# Altium schematic sheet RELAY7.SchDoc
size A
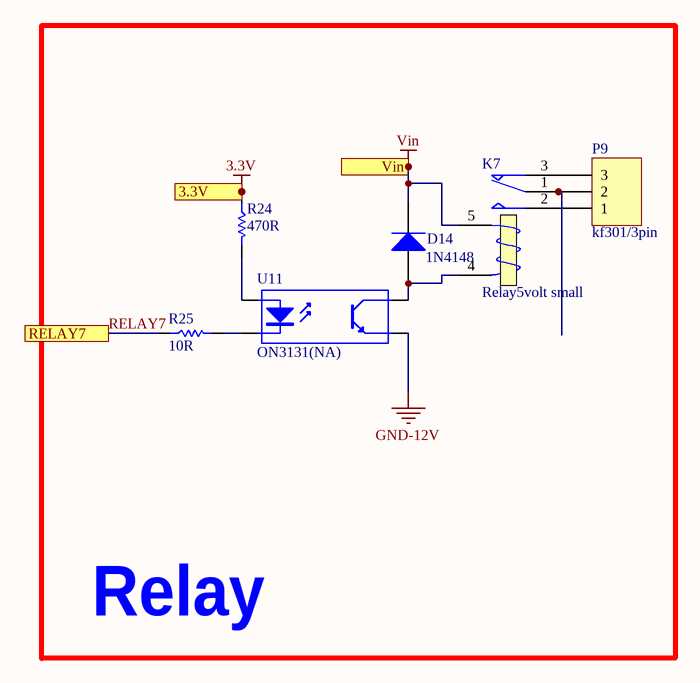
[diagram p0: RELAY7.SchDoc]

## Parts
D14  1N4148  [sod123]
K7  Relay5volt small  [relay5_childern]
P9  kf301/3pin  [Blue Connector 1*3 -kf301]
R24  470R  [0805/resistor]
R25  10R  [0805/resistor]
U11  ON3131(NA)  [OPTO_COUPLER]

## Blocks framed on the sheet
Relay: D14 K7 P9 R24 R25 U11

## Ports
3.3V, RELAY7, Vin

## Nets
3.3V: R24.1 ; port 3.3V
GND-12V: U11.3(E)
Vin: D14.K K7.5 ; port Vin
RELAY7: R25.1 ; port RELAY7
NetD14_A: D14.A K7.4(T2) U11.4(C)
NetK7_1: K7.1(COM) P9.2
NetK7_2: K7.2(NO) P9.1
NetK7_3: K7.3(T1) P9.3
NetR24_2: R24.2 U11.1(A)
NetR25_2: R25.2 U11.2(K)

## Library data of the parts
D14 = Diode 1N4007: 1 Amp General Purpose Rectifier; Published: 8-Jun-2000; LatestRevisionDate: 17-Jul-2002; LatestRevisionNote: Re-released for DXP Platform.; DatasheetVersion: 1998; PackageVersion: Aug-1999; PackageReference: DO-41; Publisher: Altium Limited; PackageDescription: Diode, Axial; Body 5.2 x 2.7 mm (LxDia. max), Lead Dia. 0.86 mm (max); Code_JEDEC: DO-204-AL; ComponentLink1Description: Manufacturer Link; ComponentLink1URL: http://www.fairchildsemi.com/; ComponentLink2Description: Datasheet; ComponentLink2URL: http://www.fairchildsemi.com/ds/1N%2F1N4001.pdf
K7 = Relay: SPDT Relay; Published: 8-Jun-2000; LatestRevisionDate: 17-Jul-2002; LatestRevisionNote: Re-released for DXP Platform.; PackageReference: MODULE5B; Publisher: Altium Limited
P9 = Header 3: LatestRevisionDate: 17-Jul-2002; LatestRevisionNote: Re-released for DXP Platform.; Publisher: Altium Limited
R24 R25 = Resistor: Tolerance: 5%; Power: 1/8 W
  R24: Value: 470R
  R25: Value: 10R
U11 = Optoisolator1: 4-Pin Phototransistor Optocoupler; Published: 24-Mar-1999; LatestRevisionDate: 04-Mar-2005; LatestRevisionNote: Sch pins 3 & 4 Swapped.; DatasheetVersion: Nov-2003; PackageReference: DIP-4; Publisher: Altium Limited